# Altium schematic sheet ep4ce30_c.SchDoc: EP4CEF23 - C
size OrCAD B; CheckedBy: liuchao; DrawnBy: liuchao; DocumentNumber: APEX-USB3; Revision: 3.0.0; SheetNumber: 3; SheetTotal: 9
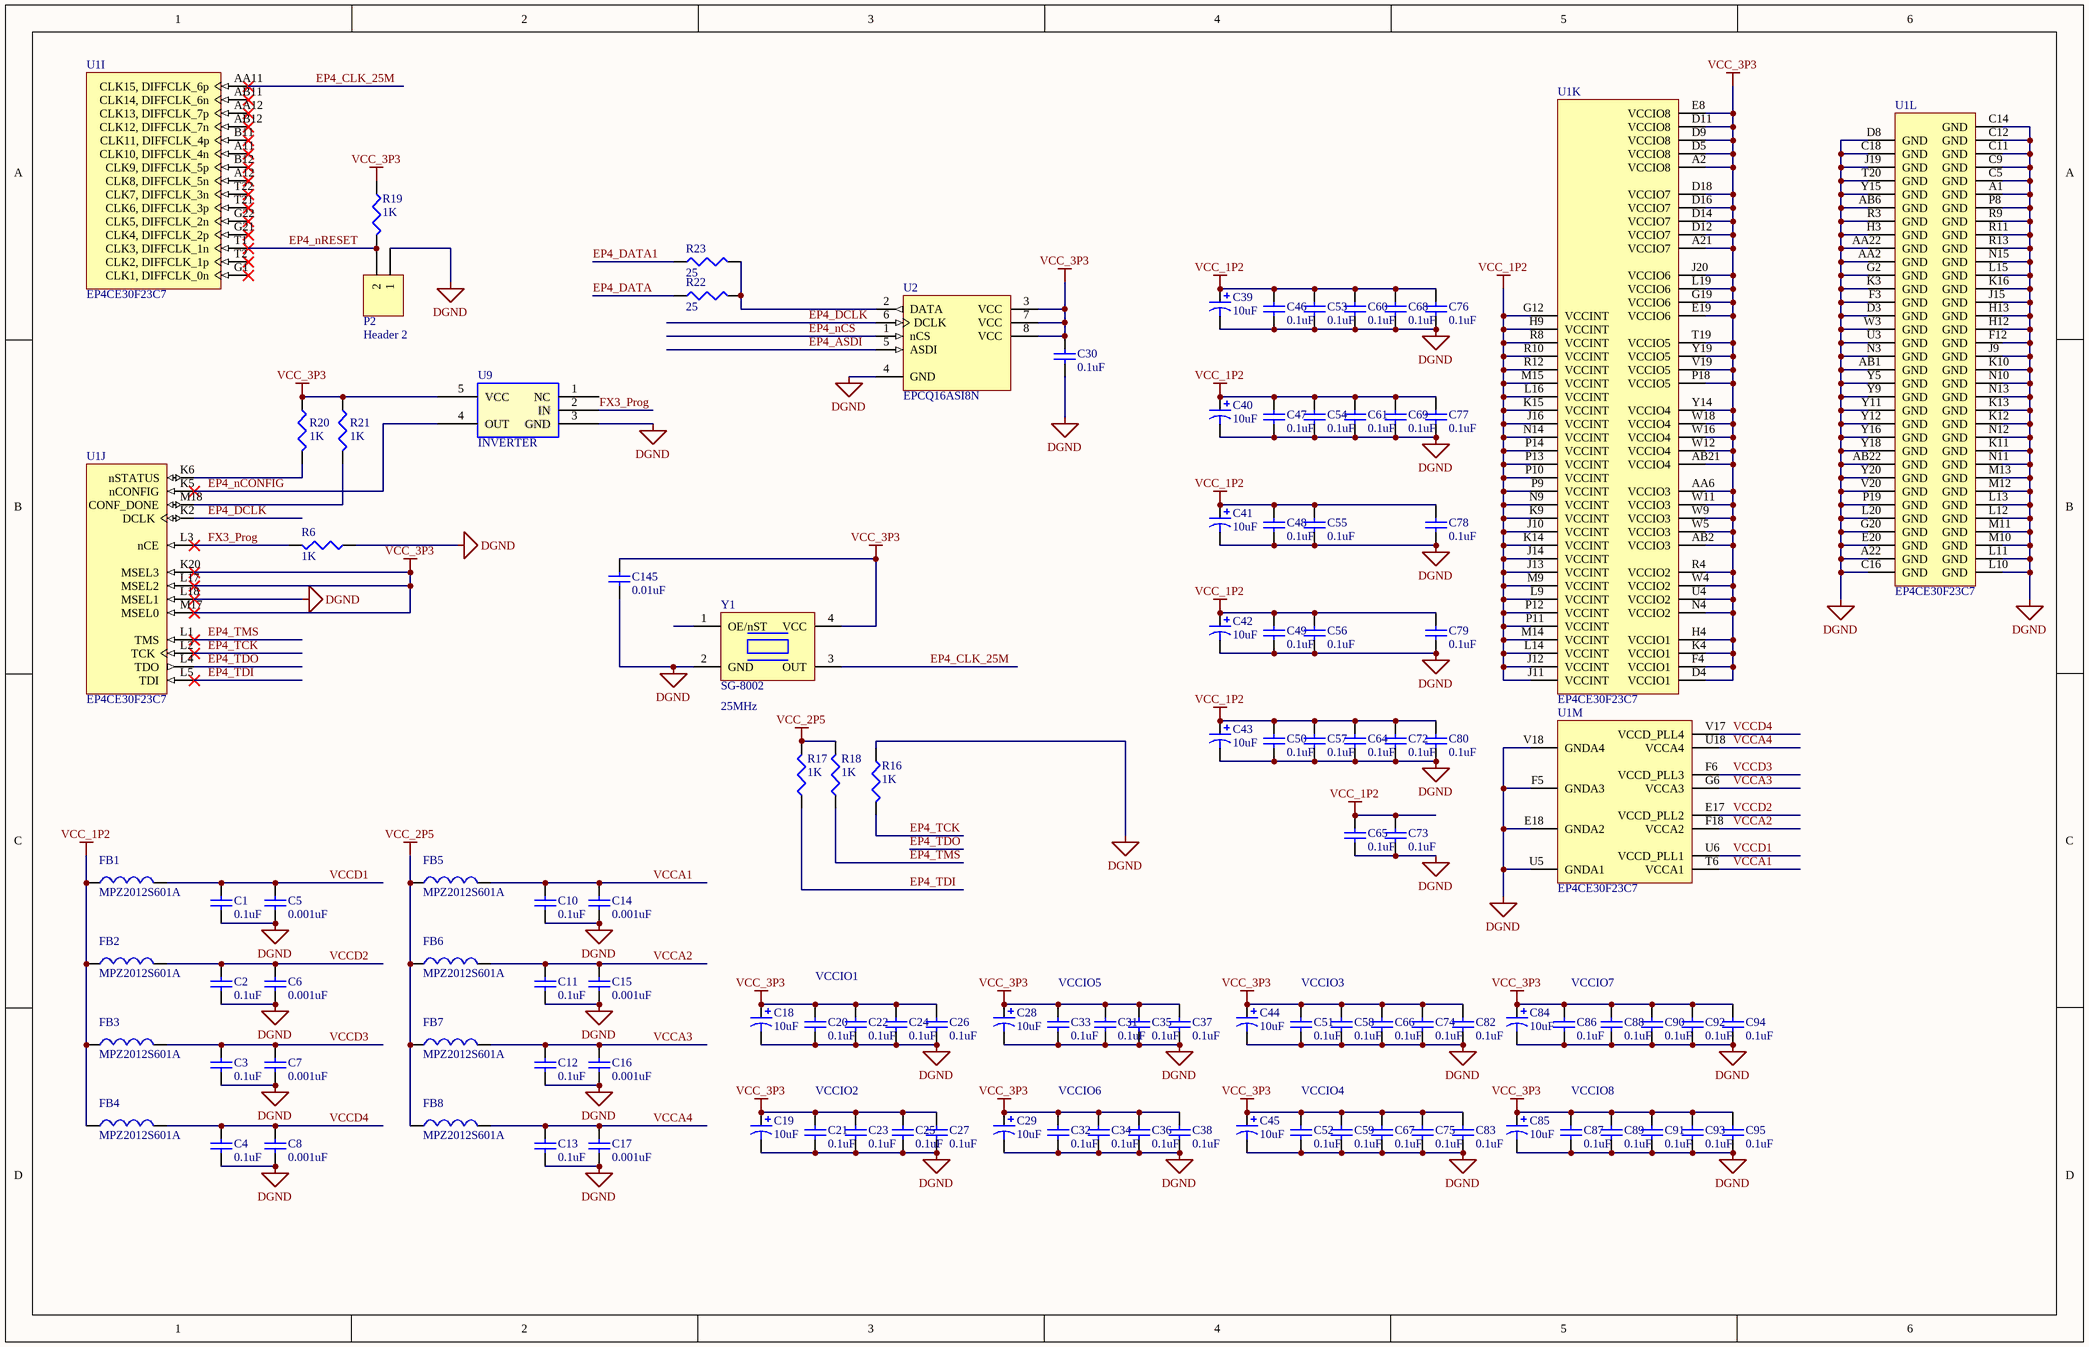
[diagram p0: ep4ce30_c.SchDoc]

## Parts
C1  value 0.1uF  [C_0402]  (hidden comment: Capacitor)
C2  value 0.1uF  [C_0402]  (hidden comment: Capacitor)
C3  value 0.1uF  [C_0402]  (hidden comment: Capacitor)
C4  value 0.1uF  [C_0402]  (hidden comment: Capacitor)
C5  value 0.001uF  [C_0402]  (hidden comment: Capacitor)
C6  value 0.001uF  [C_0402]  (hidden comment: Capacitor)
C7  value 0.001uF  [C_0402]  (hidden comment: Capacitor)
C8  value 0.001uF  [C_0402]  (hidden comment: Capacitor)
C10  value 0.1uF  [C_0402]  (hidden comment: Capacitor)
C11  value 0.1uF  [C_0402]  (hidden comment: Capacitor)
C12  value 0.1uF  [C_0402]  (hidden comment: Capacitor)
C13  value 0.1uF  [C_0402]  (hidden comment: Capacitor)
C14  value 0.001uF  [C_0402]  (hidden comment: Capacitor)
C15  value 0.001uF  [C_0402]  (hidden comment: Capacitor)
C16  value 0.001uF  [C_0402]  (hidden comment: Capacitor)
C17  value 0.001uF  [C_0402]  (hidden comment: Capacitor)
C18  value 10uF  [CAP_B]  (hidden comment: Polarized Capacitor)
C19  value 10uF  [CAP_B]  (hidden comment: Polarized Capacitor)
C20  value 0.1uF  [C_0402]  (hidden comment: Capacitor)
C21  value 0.1uF  [C_0402]  (hidden comment: Capacitor)
C22  value 0.1uF  [C_0402]  (hidden comment: Capacitor)
C23  value 0.1uF  [C_0402]  (hidden comment: Capacitor)
C24  value 0.1uF  [C_0402]  (hidden comment: Capacitor)
C25  value 0.1uF  [C_0402]  (hidden comment: Capacitor)
C26  value 0.1uF  [C_0402]  (hidden comment: Capacitor)
C27  value 0.1uF  [C_0402]  (hidden comment: Capacitor)
C28  value 10uF  [CAP_B]  (hidden comment: Polarized Capacitor)
C29  value 10uF  [CAP_B]  (hidden comment: Polarized Capacitor)
C30  value 0.1uF  [C_0402]  (hidden comment: Capacitor)
C31  value 0.1uF  [C_0402]  (hidden comment: Capacitor)
C32  value 0.1uF  [C_0402]  (hidden comment: Capacitor)
C33  value 0.1uF  [C_0402]  (hidden comment: Capacitor)
C34  value 0.1uF  [C_0402]  (hidden comment: Capacitor)
C35  value 0.1uF  [C_0402]  (hidden comment: Capacitor)
C36  value 0.1uF  [C_0402]  (hidden comment: Capacitor)
C37  value 0.1uF  [C_0402]  (hidden comment: Capacitor)
C38  value 0.1uF  [C_0402]  (hidden comment: Capacitor)
C39  value 10uF  [CAP_B]  (hidden comment: Polarized Capacitor)
C40  value 10uF  [CAP_B]  (hidden comment: Polarized Capacitor)
C41  value 10uF  [CAP_B]  (hidden comment: Polarized Capacitor)
C42  value 10uF  [CAP_B]  (hidden comment: Polarized Capacitor)
C43  value 10uF  [CAP_B]  (hidden comment: Polarized Capacitor)
C44  value 10uF  [CAP_B]  (hidden comment: Polarized Capacitor)
C45  value 10uF  [CAP_B]  (hidden comment: Polarized Capacitor)
C46  value 0.1uF  [C_0402]  (hidden comment: Capacitor)
C47  value 0.1uF  [C_0402]  (hidden comment: Capacitor)
C48  value 0.1uF  [C_0402]  (hidden comment: Capacitor)
C49  value 0.1uF  [C_0402]  (hidden comment: Capacitor)
C50  value 0.1uF  [C_0402]  (hidden comment: Capacitor)
C51  value 0.1uF  [C_0402]  (hidden comment: Capacitor)
C52  value 0.1uF  [C_0402]  (hidden comment: Capacitor)
C53  value 0.1uF  [C_0402]  (hidden comment: Capacitor)
C54  value 0.1uF  [C_0402]  (hidden comment: Capacitor)
C55  value 0.1uF  [C_0402]  (hidden comment: Capacitor)
C56  value 0.1uF  [C_0402]  (hidden comment: Capacitor)
C57  value 0.1uF  [C_0402]  (hidden comment: Capacitor)
C58  value 0.1uF  [C_0402]  (hidden comment: Capacitor)
C59  value 0.1uF  [C_0402]  (hidden comment: Capacitor)
C60  value 0.1uF  [C_0402]  (hidden comment: Capacitor)
C61  value 0.1uF  [C_0402]  (hidden comment: Capacitor)
C64  value 0.1uF  [C_0402]  (hidden comment: Capacitor)
C65  value 0.1uF  [C_0402]  (hidden comment: Capacitor)
C66  value 0.1uF  [C_0402]  (hidden comment: Capacitor)
C67  value 0.1uF  [C_0402]  (hidden comment: Capacitor)
C68  value 0.1uF  [C_0402]  (hidden comment: Capacitor)
C69  value 0.1uF  [C_0402]  (hidden comment: Capacitor)
C72  value 0.1uF  [C_0402]  (hidden comment: Capacitor)
C73  value 0.1uF  [C_0402]  (hidden comment: Capacitor)
C74  value 0.1uF  [C_0402]  (hidden comment: Capacitor)
C75  value 0.1uF  [C_0402]  (hidden comment: Capacitor)
C76  value 0.1uF  [C_0402]  (hidden comment: Capacitor)
C77  value 0.1uF  [C_0402]  (hidden comment: Capacitor)
C78  value 0.1uF  [C_0402]  (hidden comment: Capacitor)
C79  value 0.1uF  [C_0402]  (hidden comment: Capacitor)
C80  value 0.1uF  [C_0402]  (hidden comment: Capacitor)
C82  value 0.1uF  [C_0402]  (hidden comment: Capacitor)
C83  value 0.1uF  [C_0402]  (hidden comment: Capacitor)
C84  value 10uF  [CAP_B]  (hidden comment: Polarized Capacitor)
C85  value 10uF  [CAP_B]  (hidden comment: Polarized Capacitor)
C86  value 0.1uF  [C_0402]  (hidden comment: Capacitor)
C87  value 0.1uF  [C_0402]  (hidden comment: Capacitor)
C88  value 0.1uF  [C_0402]  (hidden comment: Capacitor)
C89  value 0.1uF  [C_0402]  (hidden comment: Capacitor)
C90  value 0.1uF  [C_0402]  (hidden comment: Capacitor)
C91  value 0.1uF  [C_0402]  (hidden comment: Capacitor)
C92  value 0.1uF  [C_0402]  (hidden comment: Capacitor)
C93  value 0.1uF  [C_0402]  (hidden comment: Capacitor)
C94  value 0.1uF  [C_0402]  (hidden comment: Capacitor)
C95  value 0.1uF  [C_0402]  (hidden comment: Capacitor)
C145  value 0.01uF  [C_0402]  (hidden comment: Capacitor)
FB1  MPZ2012S601A  [SMD_0805]
FB2  MPZ2012S601A  [SMD_0805]
FB3  MPZ2012S601A  [SMD_0805]
FB4  MPZ2012S601A  [SMD_0805]
FB5  MPZ2012S601A  [SMD_0805]
FB6  MPZ2012S601A  [SMD_0805]
FB7  MPZ2012S601A  [SMD_0805]
FB8  MPZ2012S601A  [SMD_0805]
P2  Header 2  [HDR1X2]
R6  value 1K  [J1-0603]  (hidden comment: Resistor)
R16  value 1K  [J1-0603]  (hidden comment: Resistor)
R17  value 1K  [J1-0603]  (hidden comment: Resistor)
R18  value 1K  [J1-0603]  (hidden comment: Resistor)
R19  value 1K  [J1-0603]  (hidden comment: Resistor)
R20  value 1K  [J1-0603]  (hidden comment: Resistor)
R21  value 1K  [J1-0603]  (hidden comment: Resistor)
R22  value 25  [J1-0603]  (hidden comment: Resistor)
R23  value 25  [J1-0603]  (hidden comment: Resistor)
U1  EP4CE30F23C7  [FBGA484_A-240]  (parts I,J,K,L,M of 13)
U2  EPCQ16ASI8N  [SOIC8_N]
U9  INVERTER  [TC7SET08FU]
Y1  SG-8002  [SON_4]

## Nets
DGND: C1.2 C2.2 C3.2 C4.1 C5.2 C6.2 C7.2 C8.2 C10.1 C11.1 C12.1 C13.1 C14.2 C15.2 C16.2 C17.2 C18.2 C19.2 C20.2 C21.2 C22.2 C23.2 C24.2 C25.2 C26.2 C27.2 C28.2 C29.2 C30.2 C31.2 C32.2 C33.2 C34.2 C35.2 C36.2 C37.2 C38.2 C39.2 C40.2 C41.2 C42.2 C43.2 C44.2 C45.2 C46.2 C47.2 C48.2 C49.2 C50.2 C51.2 C52.2 C53.2 C54.2 C55.2 C56.2 C57.2 C58.2 C59.2 C60.2 C61.2 C64.2 C65.2 C66.2 C67.2 C68.2 C69.2 C72.2 C73.2 C74.2 C75.2 C76.2 C77.2 C78.2 C79.2 C80.2 C82.2 C83.2 C84.2 C85.2 C86.2 C87.2 C88.2 C89.2 C90.2 C91.2 C92.2 C93.2 C94.2 C95.2 C145.2 P2.1 R6.1 R16.1 U1.A1(GND) U1.A22(GND) U1.AA2(GND) U1.AA22(GND) U1.AB1(GND) U1.AB6(GND) U1.AB22(GND) U1.C5(GND) U1.C9(GND) U1.C11(GND) U1.C12(GND) U1.C14(GND) U1.C16(GND) U1.C18(GND) U1.D3(GND) U1.D8(GND) U1.E18(GNDA2) U1.E20(GND) U1.F3(GND) U1.F5(GNDA3) U1.F12(GND) U1.G2(GND) U1.G20(GND) U1.H3(GND) U1.H12(GND) U1.H13(GND) U1.J9(GND) U1.J15(GND) U1.J19(GND) U1.K3(GND) U1.K10(GND) U1.K11(GND) U1.K12(GND) U1.K13(GND) U1.K16(GND) U1.L10(GND) U1.L11(GND) U1.L12(GND) U1.L13(GND) U1.L15(GND) U1.L18(MSEL1) U1.L20(GND) U1.M10(GND) U1.M11(GND) U1.M12(GND) U1.M13(GND) U1.N3(GND) U1.N10(GND) U1.N11(GND) U1.N12(GND) U1.N13(GND) U1.N15(GND) U1.P8(GND) U1.P19(GND) U1.R3(GND) U1.R9(GND) U1.R11(GND) U1.R13(GND) U1.T20(GND) U1.U3(GND) U1.U5(GNDA1) U1.V18(GNDA4) U1.V20(GND) U1.W3(GND) U1.Y5(GND) U1.Y9(GND) U1.Y11(GND) U1.Y12(GND) U1.Y15(GND) U1.Y16(GND) U1.Y18(GND) U1.Y20(GND) U2.4(GND) U9.3(GND) Y1.2(GND)
VCC_1P2: C39.1 C40.1 C41.1 C42.1 C43.1 C46.1 C47.1 C48.1 C49.1 C50.1 C53.1 C54.1 C55.1 C56.1 C57.1 C60.1 C61.1 C64.1 C65.1 C68.1 C69.1 C72.1 C73.1 C76.1 C77.1 C78.1 C79.1 C80.1 FB1.1 FB2.1 FB3.1 FB4.1 U1.G12(VCCINT) U1.H9(VCCINT) U1.J10(VCCINT) U1.J11(VCCINT) U1.J12(VCCINT) U1.J13(VCCINT) U1.J14(VCCINT) U1.J16(VCCINT) U1.K9(VCCINT) U1.K14(VCCINT) U1.K15(VCCINT) U1.L9(VCCINT) U1.L14(VCCINT) U1.L16(VCCINT) U1.M9(VCCINT) U1.M14(VCCINT) U1.M15(VCCINT) U1.N9(VCCINT) U1.N14(VCCINT) U1.P9(VCCINT) U1.P10(VCCINT) U1.P11(VCCINT) U1.P12(VCCINT) U1.P13(VCCINT) U1.P14(VCCINT) U1.R8(VCCINT) U1.R10(VCCINT) U1.R12(VCCINT)
VCC_2P5: FB5.1 FB6.1 FB7.1 FB8.1 R17.2 R18.2
VCC_3P3: C18.1 C19.1 C20.1 C21.1 C22.1 C23.1 C24.1 C25.1 C26.1 C27.1 C28.1 C29.1 C30.1 C31.1 C32.1 C33.1 C34.1 C35.1 C36.1 C37.1 C38.1 C44.1 C45.1 C51.1 C52.1 C58.1 C59.1 C66.1 C67.1 C74.1 C75.1 C82.1 C83.1 C84.1 C85.1 C86.1 C87.1 C88.1 C89.1 C90.1 C91.1 C92.1 C93.1 C94.1 C95.1 C145.1 R19.1 R20.1 R21.1 U1.A2(VCCIO8) U1.A21(VCCIO7) U1.AA6(VCCIO3) U1.AB2(VCCIO3) U1.AB21(VCCIO4) U1.D4(VCCIO1) U1.D5(VCCIO8) U1.D9(VCCIO8) U1.D11(VCCIO8) U1.D12(VCCIO7) U1.D14(VCCIO7) U1.D16(VCCIO7) U1.D18(VCCIO7) U1.E8(VCCIO8) U1.E19(VCCIO6) U1.F4(VCCIO1) U1.G19(VCCIO6) U1.H4(VCCIO1) U1.J20(VCCIO6) U1.K4(VCCIO1) U1.K20(MSEL3) U1.L17(MSEL2) U1.L19(VCCIO6) U1.M17(MSEL0) U1.N4(VCCIO2) U1.P18(VCCIO5) U1.R4(VCCIO2) U1.T19(VCCIO5) U1.U4(VCCIO2) U1.V19(VCCIO5) U1.W4(VCCIO2) U1.W5(VCCIO3) U1.W9(VCCIO3) U1.W11(VCCIO3) U1.W12(VCCIO4) U1.W16(VCCIO4) U1.W18(VCCIO4) U1.Y14(VCCIO4) U1.Y19(VCCIO5) U2.3(VCC) U2.7(VCC) U2.8(VCC) U9.5(VCC) Y1.4(VCC)
EP4_ASDI: U2.5(ASDI)
EP4_CLK_25M: U1.AA11(CLK15,_DIFFCLK_6p) Y1.3(OUT)
EP4_DATA: R22.1
EP4_DATA1: R23.1
EP4_DCLK: U1.K2(DCLK) U2.6(DCLK)
EP4_nCONFIG: U1.K5(nCONFIG) U9.4(OUT)
EP4_nCS: U2.1(nCS)
EP4_nRESET: P2.2 R19.2 U1.T1(CLK3,_DIFFCLK_1n)
EP4_TCK: R16.2 U1.L2(TCK)
EP4_TDI: R17.1 U1.L5(TDI)
EP4_TDO: U1.L4(TDO)
EP4_TMS: R18.1 U1.L1(TMS)
FX3_Prog: R6.2 U1.L3(nCE) U9.2(IN)
VCCA1: C10.2 C14.1 FB5.2 U1.T6(VCCA1)
VCCA2: C11.2 C15.1 FB6.2 U1.F18(VCCA2)
VCCA3: C12.2 C16.1 FB7.2 U1.G6(VCCA3)
VCCA4: C13.2 C17.1 FB8.2 U1.U18(VCCA4)
VCCD1: C1.1 C5.1 FB1.2 U1.U6(VCCD_PLL1)
VCCD2: C2.1 C6.1 FB2.2 U1.E17(VCCD_PLL2)
VCCD3: C3.1 C7.1 FB3.2 U1.F6(VCCD_PLL3)
VCCD4: C4.2 C8.1 FB4.2 U1.V17(VCCD_PLL4)
NetR20_2: R20.2 U1.K6(nSTATUS)
NetR21_2: R21.2 U1.M18(CONF_DONE)
NetR22_2: R22.2 R23.2 U2.2(DATA)

Not connected (* = marked no-connect by the designer): U1 A11(CLK10,_DIFFCLK_4n)* A12(CLK8,_DIFFCLK_5n)* AA12(CLK13,_DIFFCLK_7p)* AB11(CLK14,_DIFFCLK_6n)* AB12(CLK12,_DIFFCLK_7n)* B11(CLK11,_DIFFCLK_4p)* B12(CLK9,_DIFFCLK_5p)* G1(CLK1,_DIFFCLK_0n)* G21(CLK4,_DIFFCLK_2p)* G22(CLK5,_DIFFCLK_2n)* T2(CLK2,_DIFFCLK_1p)* T21(CLK6,_DIFFCLK_3p)* T22(CLK7,_DIFFCLK_3n)*; U9 1(NC); Y1 1(OE/nST)

## Notes on the sheet
- (near Y1) 25MHz
- VCCIO1
- VCCIO5
- VCCIO3
- VCCIO7
- VCCIO2
- VCCIO6
- VCCIO4
- VCCIO8

## Library data of the parts
C1-C8 C10-C17 C20-C27 C30-C38 C46-C61 C64-C69 C72-C80 C82 C83 C86-C95 C145 = Cap Semi: Capacitor (Semiconductor SIM Model); Published: 8-Jun-2000; LatestRevisionDate: 29-May-2009; LatestRevisionNote: IPC-7351 Footprint Added.; PackageReference: C1206; Publisher: Altium Limited; PackageDescription: Chip Capacitor
C18 C19 C28 C29 C39-C45 C84 C85 = Cap Pol3: Polarized Capacitor (Surface Mount); Published: 8-Jun-2000; LatestRevisionDate: 29-May-2009; LatestRevisionNote: IPC-7351 Footprint Added.; PackageReference: C0805; Publisher: Altium Limited; PackageDescription: Chip Capacitor
FB1-FB8 = MPZ2012X
P2 = Header 2: Header, 2-Pin; LatestRevisionDate: 17-Jul-2002; LatestRevisionNote: Re-released for DXP Platform.; Publisher: Altium Limited
R6 R16-R23 = Res3: Published: 8-Jun-2000; LatestRevisionDate: 29-May-2009; LatestRevisionNote: IPC-7351 Footprint Added.; PackageReference: J1-0603; Publisher: Altium Limited; PackageDescription: Chip Resistor
U1 = EP4CE30F23C7: Cyclone IV Family FPGA, 1.2V Core, 328 I/O Pins, 4 PLLs, 484-Pin FBGA, Speed Grade 7, Commercial Grade; Manufacturer: Altera; DatasheetVersion: ver1.6, Nov-2011; PackageVersion: ver1.0, Jun-2011; PackageReference: FBGA484_A-240; PackageDescription: 484-Pin FineLine Ball Grid Array (FBGA) - Wire Bond - A:2.40; Code_JEDEC: MS-034-AAJ-1; ComponentLink1Description: Manufacturer URL; ComponentLink1URL: http://www.altera.com/; ComponentLink2Description: Handbook; ComponentLink2URL: http://www.altera.com/literature/hb/cyclone-iv/cyclone4-handbook.pdf; ComponentLink3Description: Pinout; ComponentLink3URL: http://www.altera.com/literature/lit-dp.jsp?category=cyc%204&showspreadsheet=y; ComponentLink4Description: Package Specification; ComponentLink4URL: http://www.altera.com/devicepackaging/04R00247-02.pdf
U2 = EPCS4SI8N: EPCS4 Series, In-system programmable 3.3V serial configuration device, 8-Pin SOIC, 4-Megabit, Industrial Grade, Pb-Free; Configures: Cyclone II, Stratix II, & Cyclone Devices; Published: 4-Mar-2005; LatestRevisionDate: 13-Apr-2006; LatestRevisionNote: IPC-7351 Footprint Added.; DatasheetVersion: ver2.0, Oct-2003; PackageVersion: ver14.2, Oct-2005; PackageReference: SOIC8; Publisher: Altium Limited; PackageDescription: 8-Pin Small Outline Integrated Circuit Package (SOIC8); Supplier 1: Digi-Key; Supplier Part Number 1: 544-1379-5-ND; Supplier 2: Farnell; Supplier Part Number 2: 1662262; Supplier 3: Farnell; Supplier Part Number 3: 1453496; Code_JEDEC: MS-012-AA; Code_IPC: SOIC127P600-8; ComponentLink1Description: Manufacturer Link; ComponentLink1URL: http://www.altera.com/products/devices/config/cfg-index.html; ComponentLink2Description: Configuration Handbook; ComponentLink2URL: http://www.altera.com/literature/hb/cfg/config_handbook.pdf; ComponentLink3Description: Pinout Specification; ComponentLink3URL: http://www.altera.com/literature/hb/cfg/cyc_c51014.pdf; ComponentLink4Description: Packaging Specification; ComponentLink4URL: http://www.altera.com/literature/ds/dspkg.pdf
Y1 = SG-8002: OSC XO CMOS SMD